# Altium project EEG_circuit.PrjPcb (part 3 of 3)
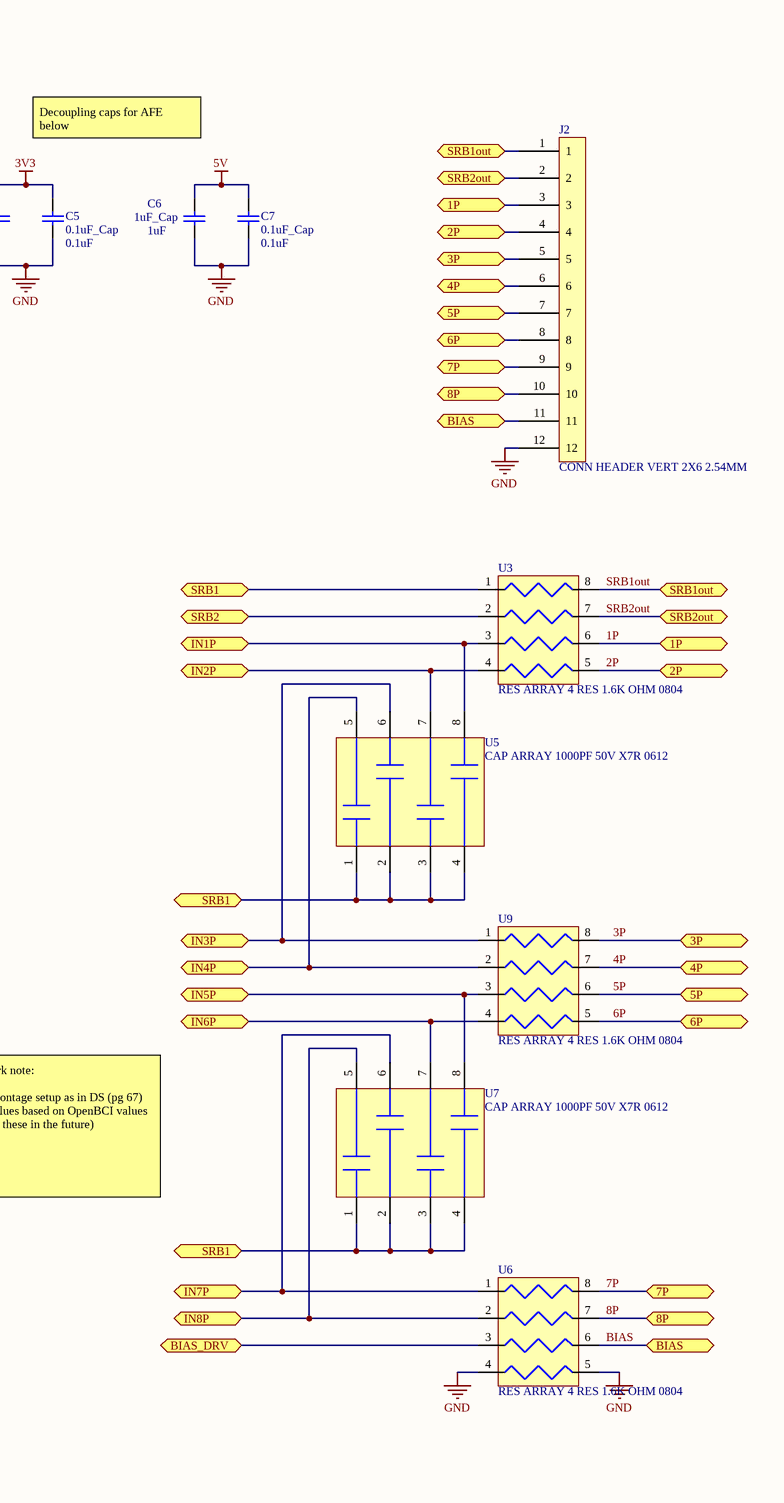
[diagram p3: EEG_schematic.SchDoc, right]

## Sheet EEG_schematic.SchDoc (continued)

### Library data of the parts (continued)
Y1 = XTAL: Crystal Oscillator; Manufacturer: ECS International; Manufacturer Part Number: ECS-80-18-30-JGN-TR; Frequency: 8MHz; Load Capacitance: 18pF; ESR (Equivalent Series Resistance): 100R; Frequency Stability: 30ppm; Frequency Tolerance: 20ppm; Published: 8-Jun-2000; LatestRevisionDate: 17-Jul-2002; LatestRevisionNote: Re-released for DXP Platform.; PackageReference: R38; Publisher: Altium Limited; PackageDescription: Crystal, Thru-Hole; 2 Leads; Body 3.1 x 8.2 mm (Dia.xH); Supplier 1: Digi-Key; Stock 1: 5339; Pricing 1: 1=0.69, 10=0.607, 50=0.5676, 100=0.5016, 500=0.4752 (USD); Mount: Surface Mount; Case/Package: SMD/SMT; Min Operating Temperature: -40°C; Max Operating Temperature: 85°C; Packaging: Tape and Reel; Length: 0.197inch; Height: 0.055inch; Width: 0.126inch; ComponentLink1URL: http://www.mouser.com/ds/2/122/ecx-53r-17605.pdf?src-supplier=Mouser; ComponentLink1Description: http://www.mouser.com/ds/2/122/ecx-53r-17605.pdf?src-supplier=Mouser; ComponentLink2URL: http://www.ecsxtal.com/store/pdf/partnumber4.pdf?src-supplier=Digi-Key; ComponentLink2Description: http://www.ecsxtal.com/store/pdf/partnumber4.pdf?src-supplier=Digi-Key; ComponentLink3URL: http://www.ecsxtal.com/store/pdf/ecx-53r.pdf?src-supplier=Digi-Key; ComponentLink3Description: http://www.ecsxtal.com/store/pdf/ecx-53r.pdf?src-supplier=Digi-Key